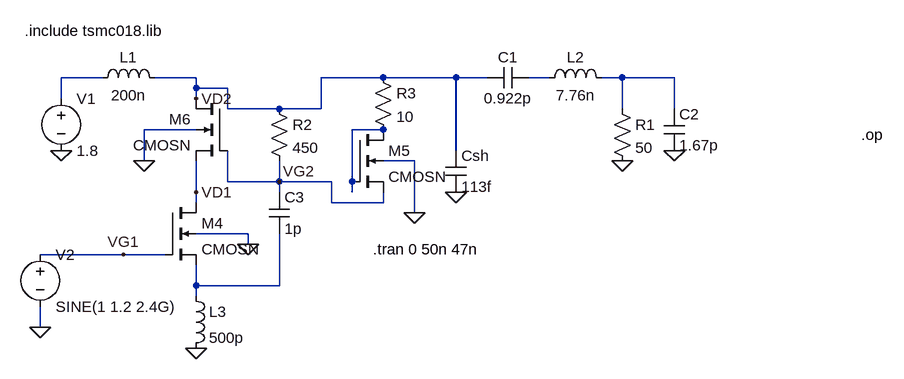
[diagram p0: schematic BOOTSTRAPED.asc]
BOOTSTRAPED.asc, the LTspice schematic file:
Version 4
SHEET 1 1068 680
WIRE -512 96 -576 96
WIRE -368 96 -432 96
WIRE -80 96 -176 96
WIRE 32 96 -80 96
WIRE 80 96 32 96
WIRE 176 96 144 96
WIRE 288 96 256 96
WIRE 368 96 288 96
WIRE -368 112 -368 96
WIRE -320 112 -368 112
WIRE -576 128 -576 96
WIRE -368 128 -368 112
WIRE -320 144 -320 112
WIRE -240 144 -320 144
WIRE -176 144 -176 96
WIRE -176 144 -240 144
WIRE 288 144 288 96
WIRE 368 144 368 96
WIRE -368 176 -448 176
WIRE -80 176 -128 176
WIRE 32 208 32 96
WIRE -448 224 -448 176
WIRE -32 224 -80 224
WIRE -320 256 -320 208
WIRE -240 256 -240 224
WIRE -240 256 -320 256
WIRE -160 256 -240 256
WIRE -128 256 -128 176
WIRE -368 272 -368 224
WIRE -240 272 -240 256
WIRE -128 272 -128 256
WIRE -368 288 -368 272
WIRE -160 288 -160 256
WIRE -80 288 -80 272
WIRE -80 288 -160 288
WIRE -32 304 -32 224
WIRE -288 336 -368 336
WIRE -288 352 -288 336
WIRE -480 368 -608 368
WIRE -416 368 -480 368
WIRE -368 416 -368 384
WIRE -240 416 -240 336
WIRE -240 416 -368 416
WIRE -368 432 -368 416
WIRE -608 480 -608 448
FLAG -368 512 0
FLAG -608 480 0
FLAG -576 208 0
FLAG 368 208 0
FLAG 288 224 0
FLAG 32 272 0
FLAG -32 304 0
FLAG -288 352 0
FLAG -448 224 0
FLAG -368 128 VD2
FLAG -240 256 VG2
FLAG -480 368 VG1
FLAG -368 272 VD1
SYMBOL voltage -576 112 R0
WINDOW 123 0 0 Left 0
WINDOW 39 0 0 Left 0
SYMATTR InstName V1
SYMATTR Value 1.8
SYMBOL voltage -608 352 R0
WINDOW 123 0 0 Left 0
WINDOW 39 0 0 Left 0
SYMATTR InstName V2
SYMATTR Value SINE(1 1.2 2.4G)
SYMBOL ind -416 112 M270
WINDOW 0 32 56 VTop 2
WINDOW 3 5 56 VBottom 2
SYMATTR InstName L1
SYMATTR Value 200n
SYMBOL ind -384 416 R0
SYMATTR InstName L3
SYMATTR Value 500p
SYMBOL cmosn -416 288 R0
SYMATTR InstName M4
SYMATTR Value2 l=0.18u w=6u m=19
SYMBOL cmosn -128 176 R0
SYMATTR InstName M5
SYMATTR Value2 l=0.18u w=6u m=2
SYMBOL cmosn -320 128 M0
SYMATTR InstName M6
SYMATTR Value2 l=0.18u w=6u m=19
SYMBOL res -256 128 R0
SYMATTR InstName R2
SYMATTR Value 450
SYMBOL res -96 80 R0
SYMATTR InstName R3
SYMATTR Value 10
SYMBOL cap -256 272 R0
SYMATTR InstName C3
SYMATTR Value 1p
SYMBOL cap 144 80 R90
WINDOW 0 0 32 VBottom 2
WINDOW 3 32 32 VTop 2
SYMATTR InstName C1
SYMATTR Value 0.922p
SYMBOL cap 16 208 R0
SYMATTR InstName Csh
SYMATTR Value 113f
SYMBOL cap 352 144 R0
SYMATTR InstName C2
SYMATTR Value 1.67p
SYMBOL ind 160 112 R270
WINDOW 0 32 56 VTop 2
WINDOW 3 5 56 VBottom 2
SYMATTR InstName L2
SYMATTR Value 7.76n
SYMBOL res 272 128 R0
SYMATTR InstName R1
SYMATTR Value 50
TEXT -632 24 Left 2 !.include tsmc018.lib
TEXT -96 360 Left 2 !.tran 0 50n 47n
TEXT 656 184 Left 2 !.op

The netlist it stands for:
* BOOTSTRAPED.asc
V1 N001 0 1.8
V2 VG1 0 SINE(1 1.2 2.4G)
L1 VD2 N001 200n
L3 N005 0 500p
M4 VD1 VG1 N005 0 CMOSN l=0.18u w=6u m=19
M5 N004 N004 VG2 0 CMOSN l=0.18u w=6u m=2
M6 VD2 VG2 VD1 0 CMOSN l=0.18u w=6u m=19
R2 VD2 VG2 450
R3 VD2 N004 10
C3 VG2 N005 1p
C1 N002 VD2 0.922p
Csh VD2 0 113f
C2 N003 0 1.67p
L2 N002 N003 7.76n
R1 N003 0 50
.model NMOS NMOS
.model PMOS PMOS
.lib standard.mos
.include tsmc018.lib
.tran 0 50n 47n
.op
.backanno
.end